# EAGLE design polivalka (EAGLE 8.3.2)
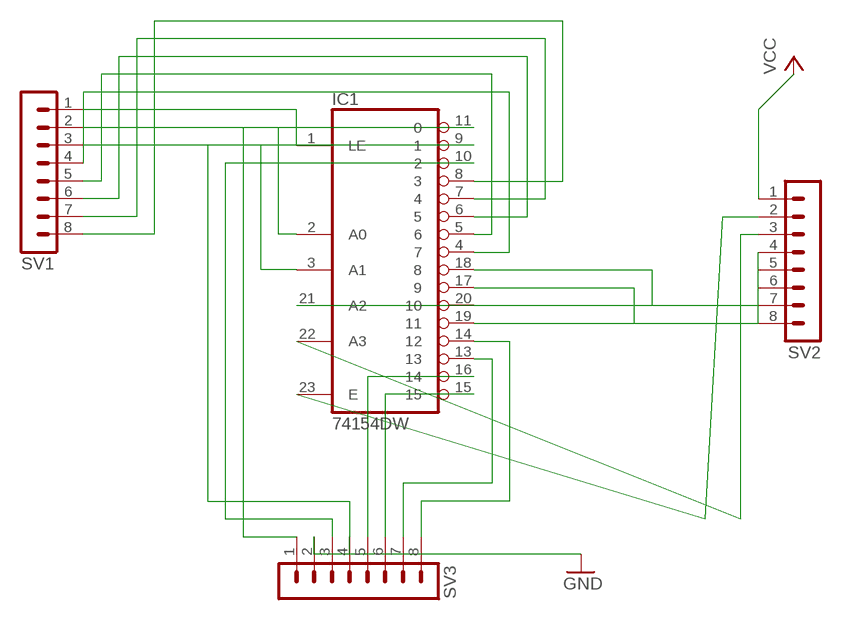
[diagram p0: schematic, sheet 1]

## Parts
IC1  74154DW  [SO24W]
SV1  MA08-1  [MA08-1]
SV2  MA08-1  [MA08-1]
SV3  MA08-1  [MA08-1]

## Nets
GND: SV3.2
N$1: IC1.1(LE) SV1.1
N$2: IC1.2(A0) SV1.2
N$3: IC1.3(A1) SV1.3
N$4: IC1.4 SV1.4
N$5: IC1.5 SV1.5
N$6: IC1.6 SV1.6
N$7: IC1.7 SV1.7
N$8: IC1.8 SV1.8
N$9: IC1.11 SV3.1
N$10: IC1.9 SV3.4
N$11: IC1.10 SV3.3
N$12: IC1.14 SV3.8
N$13: IC1.13 SV3.7
N$14: IC1.15 SV3.6
N$15: IC1.16 SV3.5
N$16: IC1.17 SV2.8
N$17: IC1.18 SV2.7
N$18: IC1.19 SV2.6
N$19: IC1.20 SV2.5
N$20: IC1.21(A2) SV2.4
N$21: IC1.22(A3) SV2.3
N$22: IC1.23(E) SV2.2
VCC: SV2.1

## Power pins joined to a net without a drawn wire
GND: IC1.12(GND)
VCC: IC1.24(VCC)

## Library data of the parts
IC1 = 74HC45:74*154: 4-line to 16-line data SELECTOR/MULTIPLEXER
SV1-SV3 = con-lstb:MA08-1: PIN HEADER; OC_FARNELL: unknown; OC_NEWARK: unknown

## Board
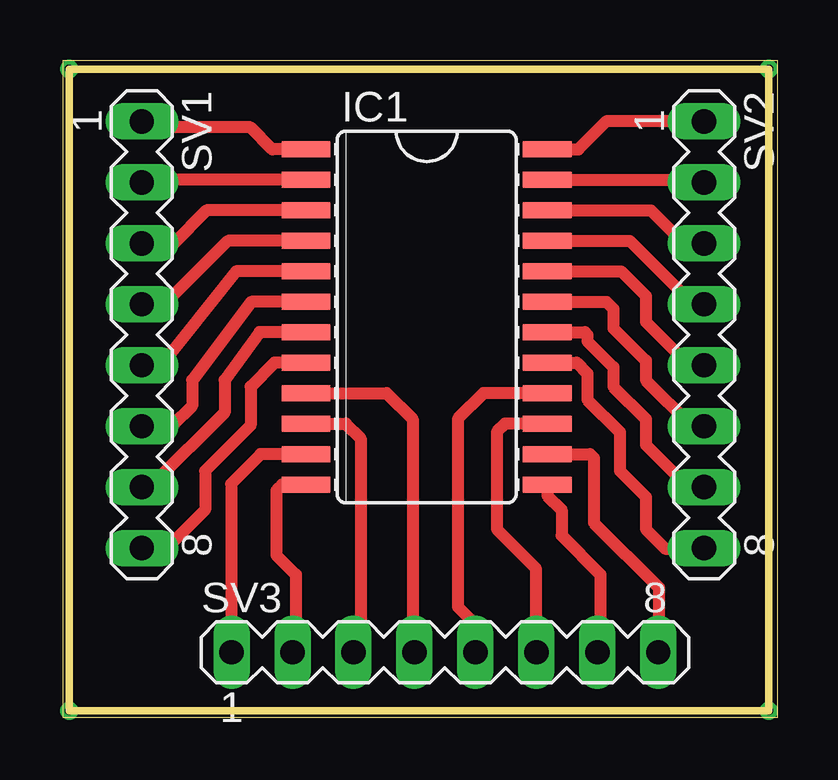
[diagram p1: board, top side]

Size 29.8 x 27.35 mm. Coordinates in mm from the lower left corner, seen from the top.
Outline: 0,0 29.8,0 29.8,27.35 0,27.35 0,0
Copper layers (1*16): Top 0.035mm / dielectric 1.5mm / Bottom 0.035mm
Design rules "default": minimum track width 6mil, minimum drill 0.35mm, track to track 6mil, track to pad 6mil, pad to pad 6mil, via to via 6mil, smd to smd 6mil, copper to edge 40mil, drill to drill 6mil, minimum pad ring 10mil, minimum via ring 8mil, stop-mask expansion 4mil, vias tented up to drill 0mil, thermal gap 10mil
Milling: 4 lines

### Footprints (pad centres in the part's own frame; a part is rotated, then mirrored left to right if it is on the bottom)
SO24W = smd 0.66 x 2.032: 1 -6.985,-5.029; 2 -5.715,-5.029; 3 -4.445,-5.029; 4 -3.175,-5.029; 5 -1.905,-5.029; 6 -0.635,-5.029; 7 0.635,-5.029; 8 1.905,-5.029; 9 3.175,-5.029; 10 4.445,-5.029; 11 5.715,-5.029; 12 6.985,-5.029; 13 6.985,5.029; 14 5.715,5.029; 15 4.445,5.029; 16 3.175,5.029; 17 1.905,5.029; 18 0.635,5.029; 19 -0.635,5.029; 20 -1.905,5.029; 21 -3.175,5.029; 22 -4.445,5.029; 23 -5.715,5.029; 24 -6.985,5.029
MA08-1 = drill 1.016 long: 1 -8.89,0; 2 -6.35,0; 3 -3.81,0; 4 -1.27,0; 5 1.27,0; 6 3.81,0; 7 6.35,0; 8 8.89,0

### Placement (x,y rotation side)
IC1  15.17,16.67 270 top
SV1  3.3,15.93 270 top
SV2  26.73,15.93 270 top
SV3  15.93,2.7 0 top

### Tracks (layer width: path | path; a pad name or v marks a point on that pad's centre or on a via)
GND
  Top 0.508: IC1.12 9.14,9.69 8.91,9.45 8.91,6.75 9.72,5.94 9.72,2.84 SV3.2
N$1
  Top 0.508: IC1.1 8.74,23.66 7.83,24.57 3.55,24.57 SV1.1
N$2
  Top 0.508: IC1.2 3.4,22.39 SV1.2
N$3
  Top 0.508: IC1.3 5.99,21.11 4.59,19.71 3.33,19.71 SV1.3
N$4
  Top 0.508: IC1.4 6.88,19.84 4.32,17.28 3.38,17.28 SV1.4
N$5
  Top 0.508: IC1.5 7.23,18.57 4.05,14.58 3.38,14.58 SV1.5
N$6
  Top 0.508: IC1.6 7.86,17.3 5.4,14.04 5.4,12.96 4.59,12.15 3.33,12.15 SV1.6
N$7
  Top 0.508: IC1.7 8.21,16.04 6.75,14.04 6.75,12.69 3.78,9.72 3.44,9.72 SV1.7
N$8
  Top 0.508: IC1.8 8.82,14.77 7.83,13.77 7.83,12.15 5.94,10.26 5.94,8.64 4.32,7.02 3.32,7.02 SV1.8
N$9
  Top 0.508: IC1.11 8.26,10.96 7.02,9.72 7.02,2.72 SV3.1
N$10
  Top 0.508: IC1.9 13.5,13.49 14.58,12.42 14.58,2.78 SV3.4
N$11
  Top 0.508: IC1.10 11.8,12.22 12.42,11.61 12.42,3 SV3.3
N$12
  Top 0.508: IC1.14 21.98,10.96 22.14,10.8 22.14,8.1 24.84,5.4 24.84,2.72 SV3.8
N$13
  Top 0.508: IC1.13 20.2,9.23 20.79,8.64 20.79,7.56 22.41,5.94 22.41,2.83 SV3.7
N$14
  Top 0.508: IC1.15 18.43,12.22 18.09,11.88 18.09,7.83 19.71,6.21 19.71,2.73 SV3.6
N$15
  Top 0.508: IC1.16 17.54,13.49 16.47,12.42 16.47,4.59 17.28,3.78 17.28,2.78 SV3.5
N$16
  Top 0.508: IC1.17 21.41,14.77 21.87,14.31 21.87,13.23 23.22,11.88 23.22,10.26 24.3,9.18 24.3,7.83 25.11,7.02 26.71,7.02 SV2.8
N$17
  Top 0.508: IC1.18 21.77,16.04 21.87,15.93 21.87,15.66 22.95,14.58 22.95,13.77 24.3,12.42 24.3,11.34 26.19,9.45 26.6,9.45 SV2.7
N$18
  Top 0.508: IC1.19 22.66,17.3 22.95,17.01 22.95,16.2 24.3,14.85 24.3,14.04 26.19,12.15 26.7,12.15 SV2.6
N$19
  Top 0.508: IC1.20 23.27,18.57 24.3,17.55 24.3,16.47 26.19,14.58 26.65,14.58 SV2.5
N$20
  Top 0.508: IC1.21 23.62,19.84 25.92,17.55 26.38,17.55 SV2.4
N$21
  Top 0.508: IC1.22 24.52,21.11 25.92,19.71 26.7,19.71 SV2.3
N$22
  Top 0.508: IC1.23 26.62,22.39 SV2.2
N$23  (via drill 0.35)
  other vias: 29.43,27
N$24  (via drill 0.35)
  other vias: 0.27,27
N$25  (via drill 0.35)
  other vias: 29.43,0.27
N$26  (via drill 0.35)
  other vias: 0.27,0.27
VCC
  Top 0.508: IC1.24 21.5,23.66 22.68,24.84 26.71,24.84 SV2.1